# Altium schematic sheet FPGA Power Supply.SchDoc
size A4
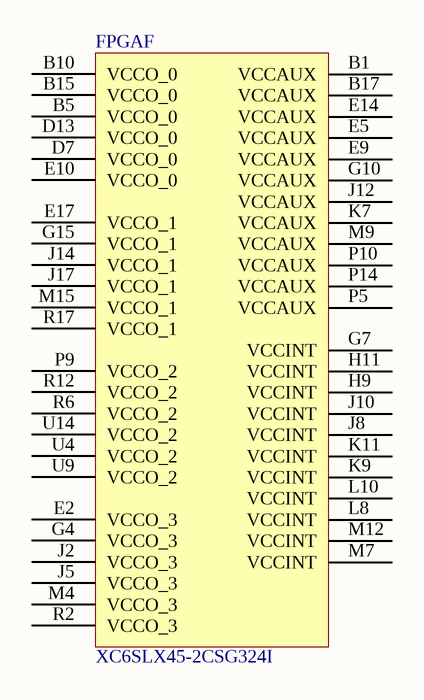
[diagram p0: FPGA Power Supply.SchDoc]

## Parts
FPGA  XC6SLX45-2CSG324I  [CSG324]  (part F of 8)

## Nets

Not connected (* = marked no-connect by the designer): FPGA B1(VCCAUX) B5(VCCO_0) B10(VCCO_0) B15(VCCO_0) B17(VCCAUX) D7(VCCO_0) D13(VCCO_0) E2(VCCO_3) E5(VCCAUX) E9(VCCAUX) E10(VCCO_0) E14(VCCAUX) E17(VCCO_1) G4(VCCO_3) G7(VCCINT) G10(VCCAUX) G15(VCCO_1) H9(VCCINT) H11(VCCINT) J2(VCCO_3) J5(VCCO_3) J8(VCCINT) J10(VCCINT) J12(VCCAUX) J14(VCCO_1) J17(VCCO_1) K7(VCCAUX) K9(VCCINT) K11(VCCINT) L8(VCCINT) L10(VCCINT) M4(VCCO_3) M7(VCCINT) M9(VCCAUX) M12(VCCINT) M15(VCCO_1) P5(VCCAUX) P9(VCCO_2) P10(VCCAUX) P14(VCCAUX) R2(VCCO_3) R6(VCCO_2) R12(VCCO_2) R17(VCCO_1) U4(VCCO_2) U9(VCCO_2) U14(VCCO_2)

## Library data of the parts
FPGA = XC6SLX45-2CSG324I: Spartan-6 LX 1.2V FPGA, 218 User I/Os, 324-Ball Chip-Scale BGA (0.8mm Pitch), Speed Grade 2, Industrial Grade, Pb-Free; Published: 17-Nov-2009; DatasheetVersion: ver1.6, Nov-2010; PackageVersion: ver1.1, Nov-2009; PackageReference: CSG324; Publisher: Altium Limited; PackageDescription: 324-Ball Chip-Scale BGA (CSG324) Package, 0.8 mm Pitch; Supplier 1: Digi-Key; Supplier Part Number 1: XC6SLX45-2CSG324I-ND; Code_JEDEC: MO-275-KKAC-1; ComponentLink1Description: Manufacturer Link; ComponentLink1URL: http://www.xilinx.com; ComponentLink2Description: Spartan-6 Datasheet; ComponentLink2URL: http://www.xilinx.com/support/documentation/data_sheets/ds160.pdf; ComponentLink3Description: Spartan-6 Documents; ComponentLink3URL: http://www.xilinx.com/support/documentation/spartan-6.htm; ComponentLink4Description: Xilinx.com Home; ComponentLink4URL: http://www.xilinx.com